# EasyEDA Pro project ProProject_Mini-Cube_2024-04-10.epro, schematic Schematic1
Create Date: 2023-05-24; Page Name: P1; Project Name: Mini-Cube; Schematic Name: Schematic1; Update Date: 2023-05-25; Company: 嘉立创EDA; Page Size: A4; Version: V1.0
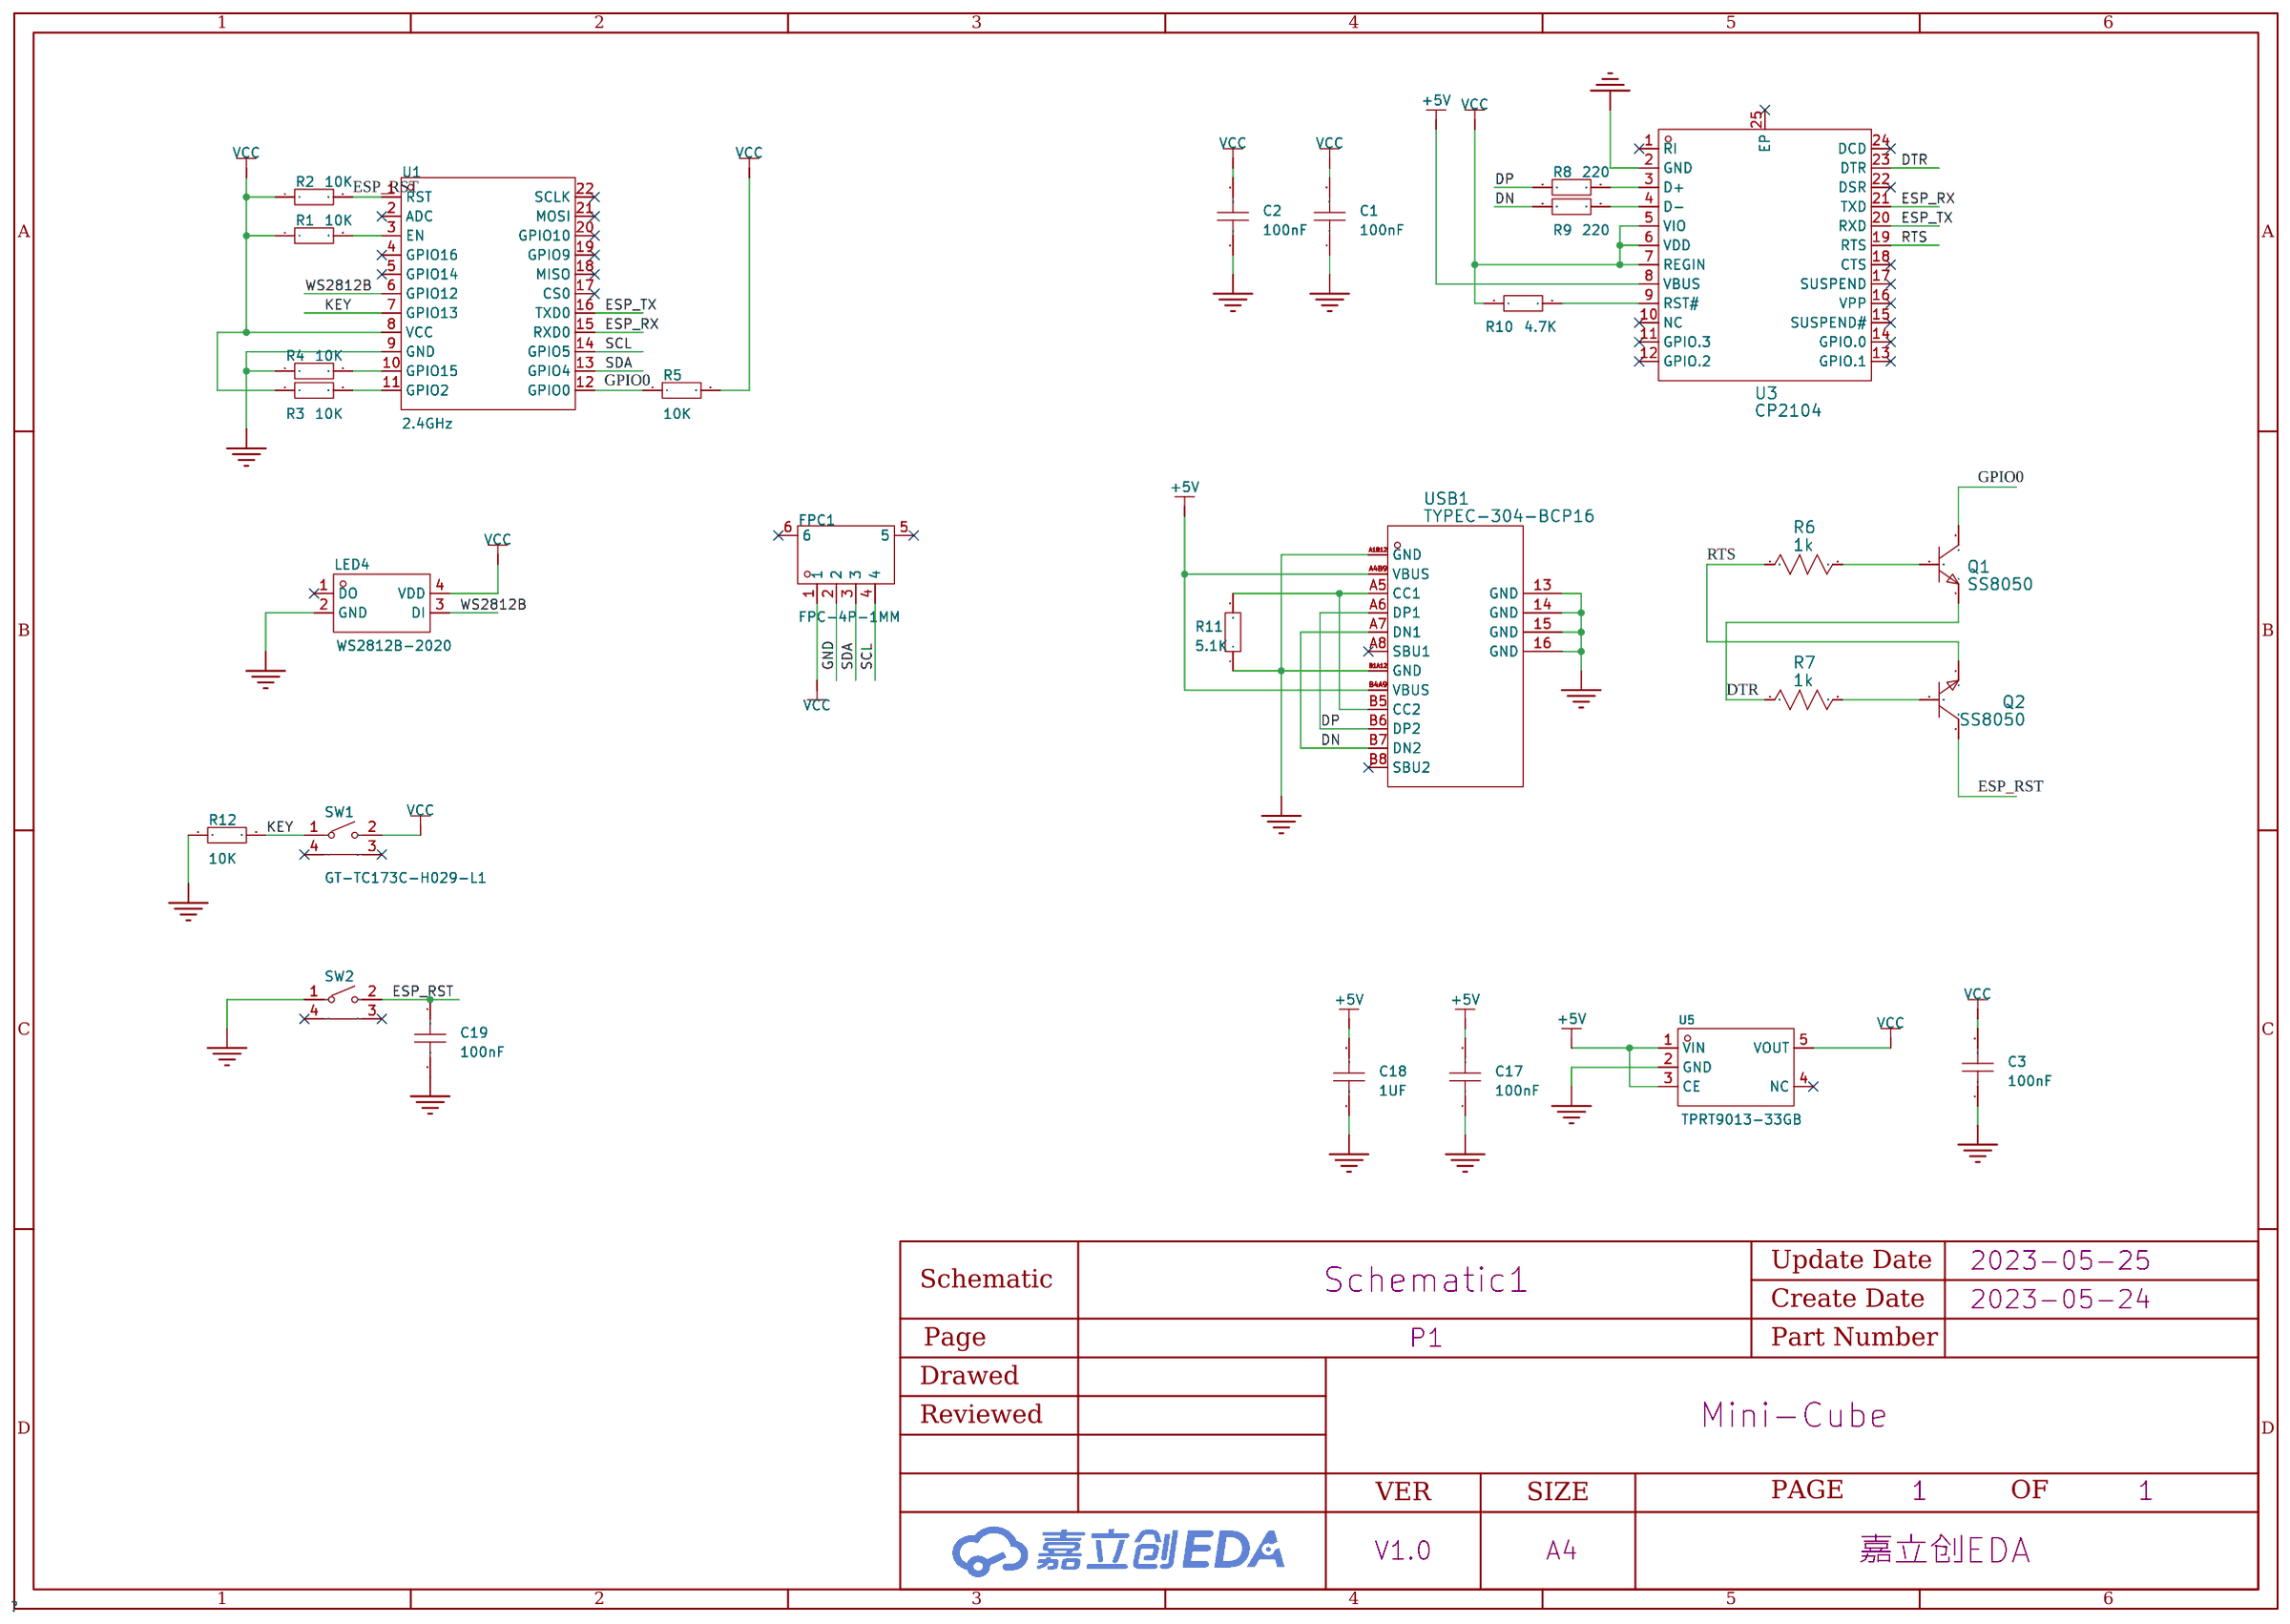
[diagram p0: schematic sheet]

## Parts
C1  100nF  [C0603]
C2  100nF  [C0603]
C3  100nF  [C0603]
C17  100nF  [C0603]
C18  1UF  [C0603]
C19  100nF  [C0603]
FPC1  FPC-4P-1MM  [FFC-SMD_FFC10032-04SBB123W5M]
LED4  WS2812B-2020  [LED-SMD_4P-L2.0-W2.0-TL_WS2812B-2020]
Q1  SS8050  [SOT-23-3_L2.9-W1.3-P1.90-LS2.4-BR]
Q2  SS8050  [SOT-23-3_L2.9-W1.3-P1.90-LS2.4-BR]
R1  10K  [R0603]
R2  10K  [R0603]
R3  10K  [R0603]
R4  10K  [R0603]
R5  10K  [R0603]
R6  1k  [R0603]
R7  1k  [R0603]
R8  220  [R0603]
R9  220  [R0603]
R10  4.7K  [R0603]
R11  5.1K  [R0603]
R12  10K  [R0603]
SW1  GT-TC173C-H029-L1  [SW-SMD_GT-TC173A-H029-L1]
SW2  GT-TC173C-H029-L1  [SW-SMD_GT-TC173A-H029-L1]
U1  2.4GHz  [WIFIM-SMD_ESP-12F-ESP8266MOD]
U3  CP2104  [QFN-24_L4.0-W4.0-P0.50-BL-EP2.7]
U5  TPRT9013-33GB  [SOT-23-5_L3.0-W1.7-P0.95-LS2.8-BL]
USB1  TYPEC-304-BCP16  [USB-C-SMD_TYPEC-304-BCP16]

## Library data of the parts
C1-C3 C17-C19 = CAP_0603: Supplier Footprint: 0603
FPC1 = FFC10032-04SBB123W5M: 间距:1mm;触点数量:4;锁定特性:翻盖式;安装类型:卧贴;触点类型:下接;工作温度范围:-25℃~+85℃;; LCSC Part Name: 4P 1.0mm; Supplier Part: C2833960; Manufacturer: TXGA(特思嘉); Supplier Footprint: SMD,P=1mm; JLCPCB Part Class: 扩展库; Datasheet: https://atta.szlcsc.com/upload/public/pdf/source/20210517/C2833960_E03CB5ECB54CF7740FC28A24F37CFDA7.pdf; Supplier: LCSC; Pitch: 1mm; Number of Contacts: 4; Locking Feature: 翻盖式; Mounting Type: 卧贴; Contact Type: 下接; Height Above Board: 2.13mm; FFC, FCB Thickness: 0.3mm~0.3mm; Operating Temperature Range: -25℃~+85℃
LED4 = WS2812B-2020: 发光颜色:RGB三色;二极管配置:-;透镜颜色:-;主波长:470.4nm；622.5nm；515.6nm;峰值波长:-;色温:-;测试电流:12mA;功率:-;发光角度:-;安装方式:-;工作温度:-;; LCSC Part Name: RGB三色 470.4nm 515.6nm 622.5nm （注意防潮，请查阅规格书中对应具体内容）; Supplier Part: C965555; Manufacturer: worldsemi; Supplier Footprint: SMD,2x2mm; JLCPCB Part Class: 扩展库; Datasheet: https://atta.szlcsc.com/upload/public/pdf/source/20201203/C965555_5C919C4B6231E6ADE06011FB0D94282B.pdf; Supplier: LCSC; Emitted Color: RGB三色; Dominant Wavelength: 470.4nm；622.5nm；515.6nm; Forward Current: 12mA
Q1 Q2 = SS8050: Supplier: LCSC; Supplier Part: C916392; Manufacturer: JSMSEMI(杰盛微); JLCPCB Part Class: Extended Part
R1-R5 R8-R12 = Res_0603: Supplier Footprint: 0603
R6 R7 = 1k
SW1 SW2 = GT-TC173C-H029-L1: 触点电流:50mA;额定电压(DC):12V;绝缘电阻:100MΩ;电路结构:单刀单掷;安装方式:立贴;按钮形状:矩形按钮;按钮/盖帽颜色:白色;带灯:无;作用力:200gf@±30gf;机械寿命:100000;工作温度:-30℃~+85℃;防护等级:IPX7;引脚样式:SMD接片;开关长度:3.9mm;开关宽度:1.55mm;开关高度:2.9mm;带支架:否;; LCSC Part Name: 防水2x3侧按轻触开关 200gf 20W寿命; Supplier Part: C2762972; Manufacturer: G-Switch(品赞); Supplier Footprint: SMD; JLCPCB Part Class: 扩展库; Datasheet: https://atta.szlcsc.com/upload/public/pdf/source/20210414/C2762972_7E1C988937AB7FB65E388C5B68027010.pdf; Supplier: LCSC; Contact Current: 50mA; Voltage Rating (DC): 12V; Insulation Resistance: 100MΩ; Circuit: 单刀单掷; Mounting Style: 立贴; Actuator Style: 矩形按钮; Actuator/Cap Color: 白色; With Lamp: 无; Operating Force: 200gf@±30gf; Mechanical Life: 100000; Operating Temperature: -30℃~+85℃; IP Rating: IPX7; Pin Style: SMD接片; Switch Length: 3.9mm; Switch Width: 1.55mm; Switch Height: 2.9mm; Strike Gundam: 否
U1 = ESP-12F(ESP8266MOD): 频率:2.4GHz;发射功率:16dBm;核心处理器:ESP8266;天线形式:PCB 板载天线;接收灵敏度:-90dBm;; LCSC Part Name: 完整的802.11b/g/n Wi-Fi的SoC模块; Supplier Part: C82891; Manufacturer: Ai-Thinker(安信可); Supplier Footprint: SMD,16x24mm; JLCPCB Part Class: 扩展库; Datasheet: https://atta.szlcsc.com/upload/public/pdf/source/20210219/C82891_ABD84A460F4F056A2757267CCCA4B508.pdf; Supplier: LCSC; Output Power: 16dBm; Core Processor: ESP8266; Support Interface: GPIO；UART；I2C；PWM；SPI；ADC; Antenna Type: PCB 板载天线; Wireless Standard: 802.11b/g/n; Operating Voltage: 3.3V; Receive  Current: 120mA; Send  Current: 170mA; Sensitivity: -90dBm; Operating Temperature: -40℃~+85℃
U3 = [JLCSMT]-CP2104-F03-GMR: Supplier: LCSC; Supplier Part: C2803296; Manufacturer: null; JLCPCB Part Class: Extended Part
U5 = TPRT9013-33GB: Supplier: LCSC; Supplier Part: C587158; Manufacturer: TECH PUBLIC(台舟); JLCPCB Part Class: Extended Part
USB1 = TYPEC-304-BCP16: Supplier: LCSC; Supplier Part: C720629; Manufacturer: XUNPU(讯普); JLCPCB Part Class: Extended Part

## Nets
+5V: C17.2 C18.2 U3.8(VBUS) U5.1(VIN) U5.3(CE) USB1.A4B9(VBUS) USB1.B4A9(VBUS)
GND: C1.1 C2.1 C3.1 C17.1 C18.1 C19.2 FPC1.2 LED4.2(GND) R4.1 R11.1 R12.1 SW2.1 U1.9(GND) U3.2(GND) U5.2(GND) USB1.13(GND) USB1.14(GND) USB1.15(GND) USB1.16(GND) USB1.A1B12(GND) USB1.B1A12(GND)
VCC: C1.2 C2.2 C3.2 FPC1.1 LED4.4(VDD) R1.1 R2.1 R3.1 R5.2 R10.1 SW1.2 U1.8(VCC) U3.5(VIO) U3.6(VDD) U3.7(REGIN) U5.5(VOUT)
DN: R9.1 USB1.A7(DN1) USB1.B7(DN2)
DP: R8.1 USB1.A6(DP1) USB1.B6(DP2)
DTR: Q1.2(E) R7.1 U3.23(DTR)
ESP_RST: C19.1 Q2.3(C) R2.2 SW2.2 U1.1(RST)
ESP_RX: U1.15(RXD0) U3.21(TXD)
ESP_TX: U1.16(TXD0) U3.20(RXD)
GPIO0: Q1.3(C) R5.1 U1.12(GPIO0)
KEY: R12.2 SW1.1 U1.7(GPIO13)
RTS: Q2.2(E) R6.1 U3.19(RTS)
SCL: FPC1.4 U1.14(GPIO5)
SDA: FPC1.3 U1.13(GPIO4)
WS2812B: LED4.3(DI) U1.6(GPIO12)
$1N764: Q2.1(B) R7.2
$1N765: Q1.1(B) R6.2
$1N803: R8.2 U3.3(D+)
$1N809: R9.2 U3.4(D-)
$1N935: R10.2 U3.9(RST#)
$1N1200: R11.2 USB1.A5(CC1) USB1.B5(CC2)
Net-(R1-2): R1.2 U1.3(EN)
Net-(R3-2): R3.2 U1.11(GPIO2)
Net-(R4-2): R4.2 U1.10(GPIO15)

Not connected (* = marked no-connect by the designer): FPC1 5* 6*; LED4 1(DO)*; SW1 3* 4*; SW2 3* 4*; U1 2(ADC)* 4(GPIO16)* 5(GPIO14)* 17(CS0)* 18(MISO)* 19(GPIO9)* 20(GPIO10)* 21(MOSI)* 22(SCLK)*; U3 1(RI)* 10(NC)* 11(GPIO.3)* 12(GPIO.2)* 13(GPIO.1)* 14(GPIO.0)* 15(SUSPEND#)* 16(VPP)* 17(SUSPEND)* 18(CTS)* 22(DSR)* 24(DCD)* 25(EP)*; U5 4(NC)*; USB1 A8(SBU1)* B8(SBU2)*
